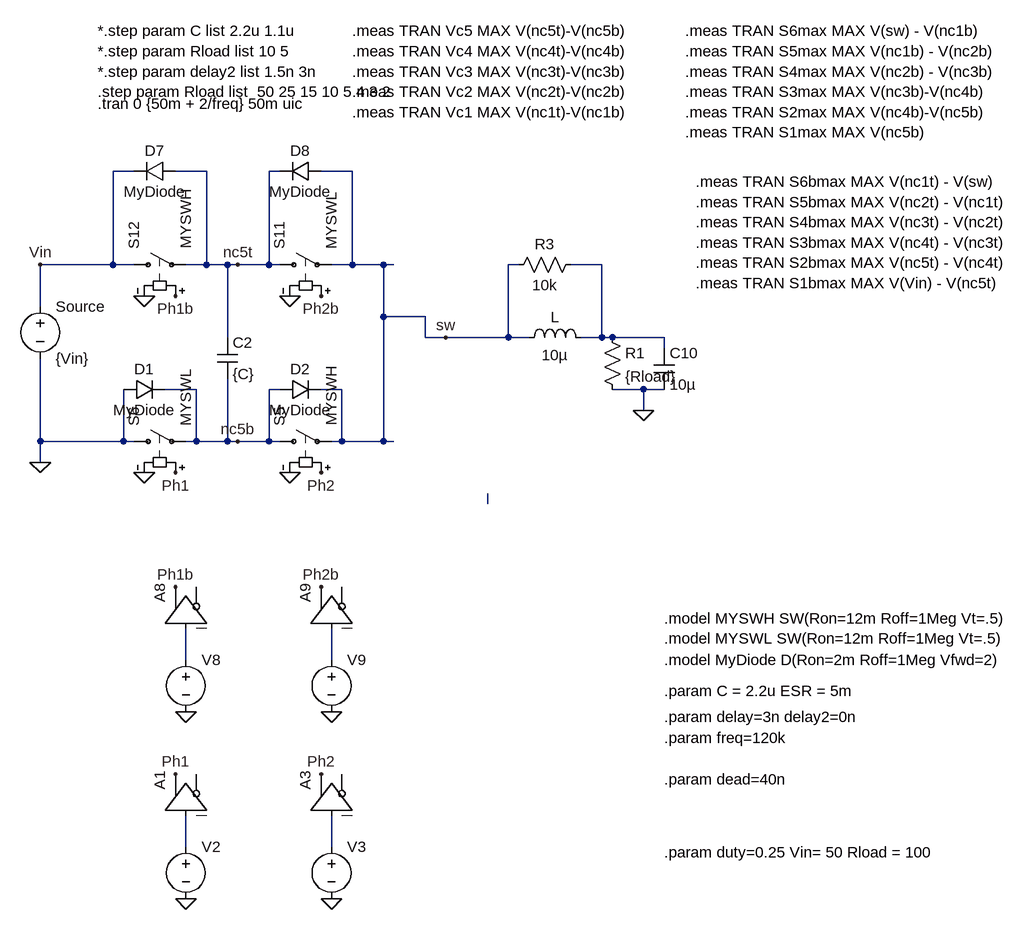
[diagram p0: schematic 3level_delay.asc]
3level_delay.asc, the LTspice schematic file:
Version 4
SHEET 1 1904 1428
WIRE -1152 -64 -1184 -64
WIRE -1040 -64 -1088 -64
WIRE -928 -64 -944 -64
WIRE -816 -64 -864 -64
WIRE -1184 80 -1184 -64
WIRE -1184 80 -1296 80
WIRE -1152 80 -1184 80
WIRE -1040 80 -1040 -64
WIRE -1040 80 -1072 80
WIRE -1008 80 -1040 80
WIRE -992 80 -1008 80
WIRE -944 80 -944 -64
WIRE -944 80 -992 80
WIRE -928 80 -944 80
WIRE -816 80 -816 -64
WIRE -816 80 -848 80
WIRE -768 80 -816 80
WIRE -752 80 -768 80
WIRE -560 80 -576 80
WIRE -432 80 -480 80
WIRE -1296 144 -1296 80
WIRE -768 160 -768 80
WIRE -704 160 -768 160
WIRE -1008 192 -1008 80
WIRE -704 192 -704 160
WIRE -672 192 -704 192
WIRE -576 192 -576 80
WIRE -576 192 -672 192
WIRE -544 192 -576 192
WIRE -432 192 -432 80
WIRE -432 192 -464 192
WIRE -416 192 -432 192
WIRE -336 192 -416 192
WIRE -336 208 -336 192
WIRE -1056 272 -1104 272
WIRE -928 272 -944 272
WIRE -832 272 -864 272
WIRE -368 272 -416 272
WIRE -336 272 -368 272
WIRE -368 304 -368 272
WIRE -1296 352 -1296 224
WIRE -1168 352 -1168 272
WIRE -1168 352 -1296 352
WIRE -1152 352 -1168 352
WIRE -1056 352 -1056 272
WIRE -1056 352 -1072 352
WIRE -1008 352 -1008 256
WIRE -1008 352 -1056 352
WIRE -992 352 -1008 352
WIRE -944 352 -944 272
WIRE -944 352 -992 352
WIRE -928 352 -944 352
WIRE -832 352 -832 272
WIRE -832 352 -848 352
WIRE -768 352 -768 160
WIRE -768 352 -832 352
WIRE -752 352 -768 352
WIRE -1296 384 -1296 352
WIRE -608 448 -608 432
WIRE -1072 688 -1072 640
WIRE -848 688 -848 640
WIRE -1072 976 -1072 928
WIRE -848 976 -848 928
FLAG -1072 1056 0
FLAG -1088 864 Ph1
FLAG -1296 80 Vin
FLAG -864 128 Ph2b
FLAG -1088 128 Ph1b
FLAG -1136 128 0
FLAG -912 128 0
FLAG -848 1056 0
FLAG -864 864 Ph2
FLAG -864 400 Ph2
FLAG -1088 400 Ph1
FLAG -1136 400 0
FLAG -912 400 0
FLAG -368 304 0
FLAG -1296 384 0
FLAG -1072 768 0
FLAG -1088 576 Ph1b
FLAG -848 768 0
FLAG -864 576 Ph2b
FLAG -992 80 nc5t
FLAG -992 352 nc5b
FLAG -672 192 sw
SYMBOL voltage -1072 960 R0
WINDOW 123 0 0 Left 2
WINDOW 39 0 0 Left 2
WINDOW 3 24 96 Invisible 2
SYMATTR Value PULSE(0 1 0 1p 1p {1/freq*(1-duty)} {1/freq})
SYMATTR InstName V2
SYMBOL Digital\\buf -1136 928 R270
SYMATTR InstName A1
SYMBOL voltage -1296 128 R0
WINDOW 123 0 0 Left 2
WINDOW 39 0 0 Left 2
SYMATTR InstName Source
SYMATTR Value {Vin}
SYMBOL sw -944 80 R270
SYMATTR InstName S11
SYMATTR Value MYSWL
SYMBOL sw -1168 80 R270
SYMATTR InstName S12
SYMATTR Value MYSWH
SYMBOL voltage -848 960 R0
WINDOW 123 0 0 Left 2
WINDOW 39 0 0 Left 2
WINDOW 3 24 96 Invisible 2
SYMATTR Value PULSE(0 1 {1/freq/2+delay} 1p 1p {1/freq*(1-duty)-delay+delay2} {1/freq})
SYMATTR InstName V3
SYMBOL Digital\\buf -912 928 R270
SYMATTR InstName A3
SYMBOL sw -944 352 R270
SYMATTR InstName S5
SYMATTR Value MYSWH
SYMBOL sw -1168 352 R270
SYMATTR InstName S6
SYMATTR Value MYSWL
SYMBOL cap -1024 192 R0
SYMATTR InstName C2
SYMATTR Value {C}
SYMATTR SpiceLine Rser={ESR}
SYMATTR SpiceLine2 IC={Vin/2}
SYMBOL ind -560 208 R270
WINDOW 0 32 56 VTop 2
WINDOW 3 5 56 VBottom 2
SYMATTR InstName L
SYMATTR Value 10µ
SYMATTR SpiceLine Rser=20m
SYMATTR SpiceLine2 ic = {Vin*duty/Rload}
SYMBOL res -432 176 R0
SYMATTR InstName R1
SYMATTR Value {Rload}
SYMBOL cap -352 208 R0
SYMATTR InstName C10
SYMATTR Value 10µ
SYMATTR SpiceLine IC={Vin*duty}
SYMATTR SpiceLine2 Rser=1m
SYMBOL voltage -1072 672 R0
WINDOW 123 0 0 Left 2
WINDOW 39 0 0 Left 2
WINDOW 3 24 96 Invisible 2
SYMATTR Value PULSE(0 1 {1/freq*(1-duty)+dead+delay} 1p 1p {1/freq*duty-dead*2-delay+delay2} {1/freq})
SYMATTR InstName V8
SYMBOL Digital\\buf -1136 640 R270
SYMATTR InstName A8
SYMBOL voltage -848 672 R0
WINDOW 123 0 0 Left 2
WINDOW 39 0 0 Left 2
WINDOW 3 24 96 Invisible 2
SYMATTR Value PULSE(0 1 {1/freq/2+1/freq*(1-duty)+dead} 1p 1p {1/freq*duty-dead*2} {1/freq})
SYMATTR InstName V9
SYMBOL Digital\\buf -912 640 R270
SYMATTR InstName A9
SYMBOL diode -1168 288 R270
WINDOW 0 32 32 VTop 2
WINDOW 3 0 32 VBottom 2
SYMATTR InstName D1
SYMATTR Value MyDiode
SYMBOL diode -928 288 R270
WINDOW 0 32 32 VTop 2
WINDOW 3 0 32 VBottom 2
SYMATTR InstName D2
SYMATTR Value MyDiode
SYMBOL diode -1088 -80 R90
WINDOW 0 0 32 VBottom 2
WINDOW 3 32 32 VTop 2
SYMATTR InstName D7
SYMATTR Value MyDiode
SYMBOL diode -864 -80 R90
WINDOW 0 0 32 VBottom 2
WINDOW 3 32 32 VTop 2
SYMATTR InstName D8
SYMATTR Value MyDiode
SYMBOL res -464 64 R90
WINDOW 0 0 56 VBottom 2
WINDOW 3 32 56 VTop 2
SYMATTR InstName R3
SYMATTR Value 10k
TEXT -1208 -168 Left 2 !.tran 0 {50m + 2/freq} 50m uic
TEXT -336 624 Left 2 !.model MYSWH SW(Ron=12m Roff=1Meg Vt=.5)\n.model MYSWL SW(Ron=12m Roff=1Meg Vt=.5)
TEXT -336 688 Left 2 !.model MyDiode D(Ron=2m Roff=1Meg Vfwd=2)
TEXT -336 776 Left 2 !.param delay=3n delay2=0n
TEXT -336 808 Left 2 !.param freq=120k
TEXT -336 984 Left 2 !.param duty=0.25 Vin= 50 Rload = 100
TEXT -336 872 Left 2 !.param dead=40n
TEXT -336 736 Left 2 !.param C = 2.2u ESR = 5m
TEXT -304 -280 Left 2 !.meas TRAN S6max MAX V(sw) - V(nc1b)\n.meas TRAN S5max MAX V(nc1b) - V(nc2b)\n.meas TRAN S4max MAX V(nc2b) - V(nc3b)\n.meas TRAN S3max MAX V(nc3b)-V(nc4b)\n.meas TRAN S2max MAX V(nc4b)-V(nc5b)\n.meas TRAN S1max MAX V(nc5b)
TEXT -816 -280 Left 2 !.meas TRAN Vc5 MAX V(nc5t)-V(nc5b)\n.meas TRAN Vc4 MAX V(nc4t)-V(nc4b)\n.meas TRAN Vc3 MAX V(nc3t)-V(nc3b)\n.meas TRAN Vc2 MAX V(nc2t)-V(nc2b)\n.meas TRAN Vc1 MAX V(nc1t)-V(nc1b)
TEXT -288 -48 Left 2 !.meas TRAN S6bmax MAX V(nc1t) - V(sw) \n.meas TRAN S5bmax MAX V(nc2t) - V(nc1t) \n.meas TRAN S4bmax MAX V(nc3t) - V(nc2t) \n.meas TRAN S3bmax MAX V(nc4t) - V(nc3t)\n.meas TRAN S2bmax MAX V(nc5t) - V(nc4t)\n.meas TRAN S1bmax MAX V(Vin) - V(nc5t)
TEXT -1208 -280 Left 2 !*.step param C list 2.2u 1.1u\n*.step param Rload list 10 5\n*.step param delay2 list 1.5n 3n\n.step param Rload list  50 25 15 10 5 4 3 2

The netlist it stands for:
* 3level_delay.asc
V2 N005 0 PULSE(0 1 0 1p 1p {1/freq*(1-duty)} {1/freq})
A1 N005 0 0 0 0 0 Ph1 0 BUF
V§Source Vin 0 {Vin}
S11 nc5t sw Ph2b 0 MYSWL
S12 Vin nc5t Ph1b 0 MYSWH
V3 N006 0 PULSE(0 1 {1/freq/2+delay} 1p 1p {1/freq*(1-duty)-delay+delay2} {1/freq})
A3 N006 0 0 0 0 0 Ph2 0 BUF
S5 nc5b sw Ph2 0 MYSWH
S6 0 nc5b Ph1 0 MYSWL
C2 nc5t nc5b {C} Rser={ESR} IC={Vin/2}
L sw N001 10µ Rser=20m ic = {Vin*duty/Rload}
R1 N001 0 {Rload}
C10 N001 0 10µ IC={Vin*duty} Rser=1m
V8 N003 0 PULSE(0 1 {1/freq*(1-duty)+dead+delay} 1p 1p {1/freq*duty-dead*2-delay+delay2} {1/freq})
A8 N003 0 0 0 0 0 Ph1b 0 BUF
V9 N004 0 PULSE(0 1 {1/freq/2+1/freq*(1-duty)+dead} 1p 1p {1/freq*duty-dead*2} {1/freq})
A9 N004 0 0 0 0 0 Ph2b 0 BUF
D1 0 nc5b MyDiode
D2 nc5b sw MyDiode
D7 nc5t Vin MyDiode
D8 sw nc5t MyDiode
R3 N001 sw 10k
.model D D
.lib standard.dio
.tran 0 {50m + 2/freq} 50m uic
.model MYSWH SW(Ron=12m Roff=1Meg Vt=.5)
.model MYSWL SW(Ron=12m Roff=1Meg Vt=.5)
.model MyDiode D(Ron=2m Roff=1Meg Vfwd=2)
.param delay=3n delay2=0n
.param freq=120k
.param duty=0.25 Vin= 50 Rload = 100
.param dead=40n
.param C = 2.2u ESR = 5m
.meas TRAN S6max MAX V(sw) - V(nc1b)
.meas TRAN S5max MAX V(nc1b) - V(nc2b)
.meas TRAN S4max MAX V(nc2b) - V(nc3b)
.meas TRAN S3max MAX V(nc3b)-V(nc4b)
.meas TRAN S2max MAX V(nc4b)-V(nc5b)
.meas TRAN S1max MAX V(nc5b)
.meas TRAN Vc5 MAX V(nc5t)-V(nc5b)
.meas TRAN Vc4 MAX V(nc4t)-V(nc4b)
.meas TRAN Vc3 MAX V(nc3t)-V(nc3b)
.meas TRAN Vc2 MAX V(nc2t)-V(nc2b)
.meas TRAN Vc1 MAX V(nc1t)-V(nc1b)
.meas TRAN S6bmax MAX V(nc1t) - V(sw)
.meas TRAN S5bmax MAX V(nc2t) - V(nc1t)
.meas TRAN S4bmax MAX V(nc3t) - V(nc2t)
.meas TRAN S3bmax MAX V(nc4t) - V(nc3t)
.meas TRAN S2bmax MAX V(nc5t) - V(nc4t)
.meas TRAN S1bmax MAX V(Vin) - V(nc5t)
*.step param C list 2.2u 1.1u
*.step param Rload list 10 5
*.step param delay2 list 1.5n 3n
.step param Rload list  50 25 15 10 5 4 3 2
.backanno
.end